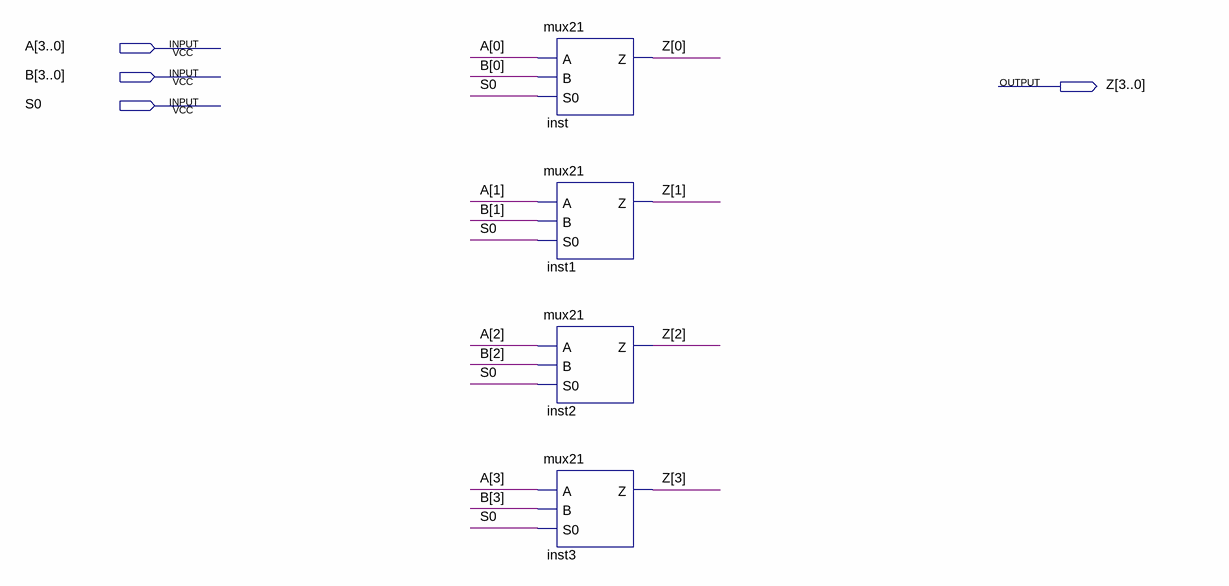
[diagram p0: schematic sheet]
// Quartus schematic mux4bits21.bdf as structural Verilog: 4 symbols, 4 pins
module mux4bits21 (
  input  [3:0] A,
  input  [3:0] B,
  input  S0,
  output [3:0] Z
);

  mux21 inst (.A(A[0]), .B(B[0]), .S0(S0), .Z(Z[0]));
  mux21 inst1 (.A(A[1]), .B(B[1]), .S0(S0), .Z(Z[1]));
  mux21 inst2 (.A(A[2]), .B(B[2]), .S0(S0), .Z(Z[2]));
  mux21 inst3 (.A(A[3]), .B(B[3]), .S0(S0), .Z(Z[3]));
endmodule
